# EAGLE design ADC33 (EAGLE 5.06)
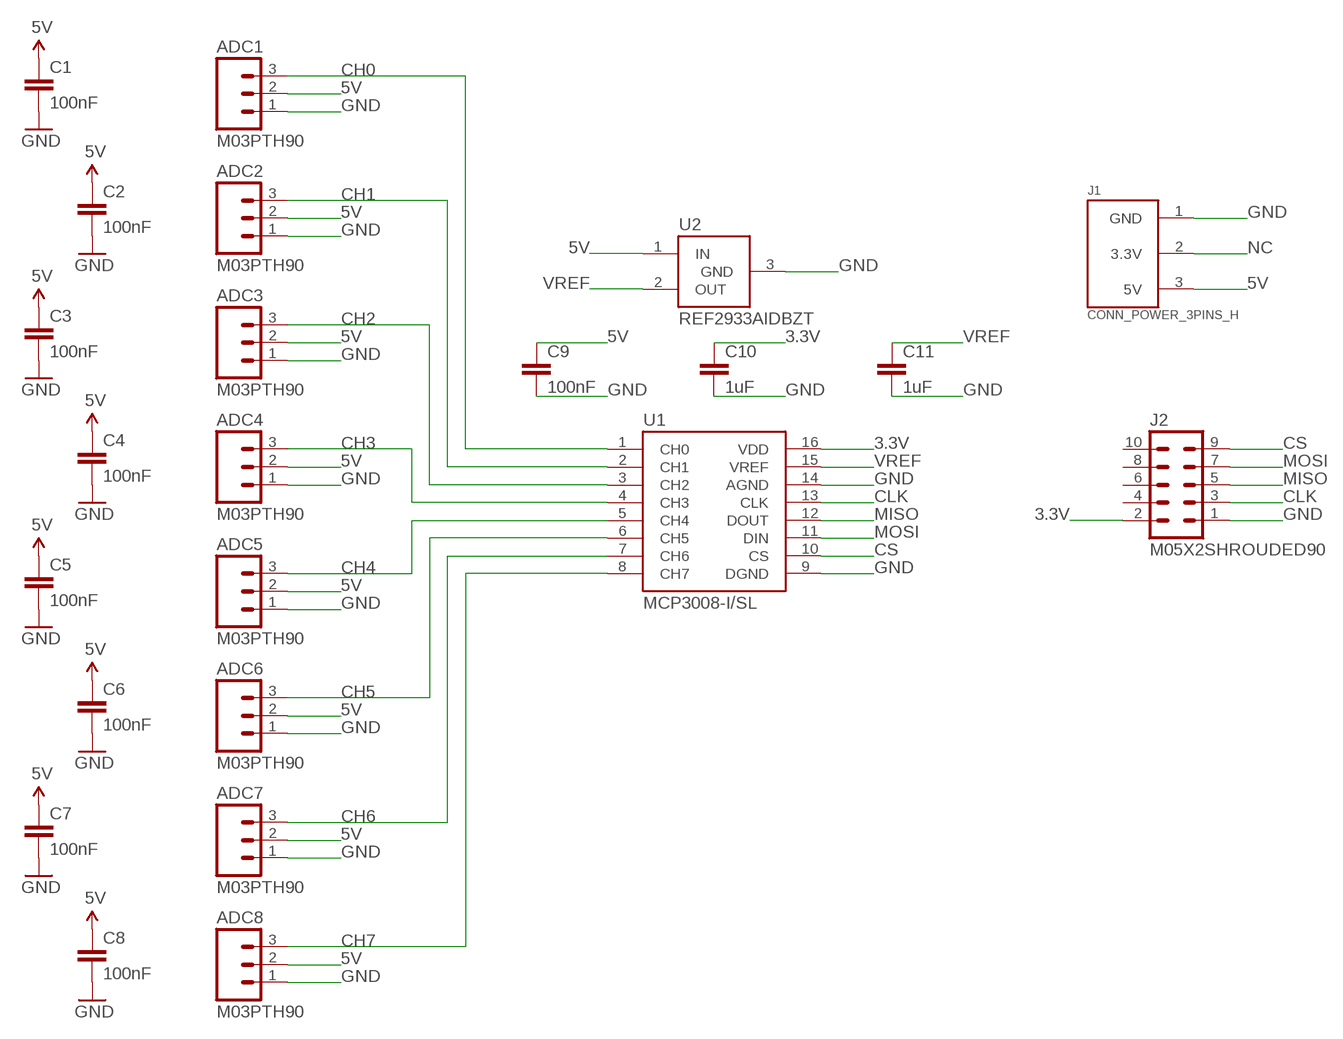
[diagram p0: schematic, sheet 1]

## Parts
ADC1  M03PTH90  [1X03/90]
ADC2  M03PTH90  [1X03/90]
ADC3  M03PTH90  [1X03/90]
ADC4  M03PTH90  [1X03/90]
ADC5  M03PTH90  [1X03/90]
ADC6  M03PTH90  [1X03/90]
ADC7  M03PTH90  [1X03/90]
ADC8  M03PTH90  [1X03/90]
C1  100nF  CAP0805  [0805]
C2  100nF  CAP0805  [0805]
C3  100nF  CAP0805  [0805]
C4  100nF  CAP0805  [0805]
C5  100nF  CAP0805  [0805]
C6  100nF  CAP0805  [0805]
C7  100nF  CAP0805  [0805]
C8  100nF  CAP0805  [0805]
C9  100nF  CAP0805  [0805]
C10  1uF  CAP0805  [0805]
C11  1uF  CAP0805  [0805]
J1  CONN_POWER_3PINS_H  [3PINS_3.81MM_90DEG]
J2  M05X2SHROUDED90  [2X05/90/SHROUDED]
U1  MCP3008-I/SL  [SOIC-16]
U2  REF2933AIDBZT  [SOT23-3]

## Nets
3.3V: C10.1 J2.2 U1.16(VDD)
5V: ADC1.2 ADC2.2 ADC3.2 ADC4.2 ADC5.2 ADC6.2 ADC7.2 ADC8.2 C1.1 C2.1 C3.1 C4.1 C5.1 C6.1 C7.1 C8.1 C9.1 J1.3(5V) U2.1(IN)
CH0: ADC1.3 U1.1(CH0)
CH1: ADC2.3 U1.2(CH1)
CH2: ADC3.3 U1.3(CH2)
CH3: ADC4.3 U1.4(CH3)
CH4: ADC5.3 U1.5(CH4)
CH5: ADC6.3 U1.6(CH5)
CH6: ADC7.3 U1.7(CH6)
CH7: ADC8.3 U1.8(CH7)
CLK: J2.3 U1.13(CLK)
CS: J2.9 U1.10(CS)
GND: ADC1.1 ADC2.1 ADC3.1 ADC4.1 ADC5.1 ADC6.1 ADC7.1 ADC8.1 C1.2 C2.2 C3.2 C4.2 C5.2 C6.2 C7.2 C8.2 C9.2 C10.2 C11.2 J1.1(GND) J2.1 U1.9(DGND) U1.14(AGND) U2.3(GND)
MISO: J2.5 U1.12(DOUT)
MOSI: J2.7 U1.11(DIN)
NC: J1.2(3.3V)
VREF: C11.1 U1.15(VREF) U2.2(OUT)
Unconnected: J2.4 J2.6 J2.8 J2.10

## Library data of the parts
ADC1-ADC8 = Robot:M03: 3-PIN HEADER Standard 3-pin 0.1" header.
C1-C11 = Robot:CAP: CAPACITOR
J1 = Robot:CONN_POWER_3PINS: POWER CONNECTOR for logic boards. Provides 3.3V and 5V.
J2 = Robot:M05X2: 10-PIN DUAL ROW HEADER Standard 10-pin dual row 0.1" header.
U1 = Robot:MCP3008: MCP3008 8-channel 10-bit A/D converter with SPI Interface
U2 = Robot:REF2933

## Board
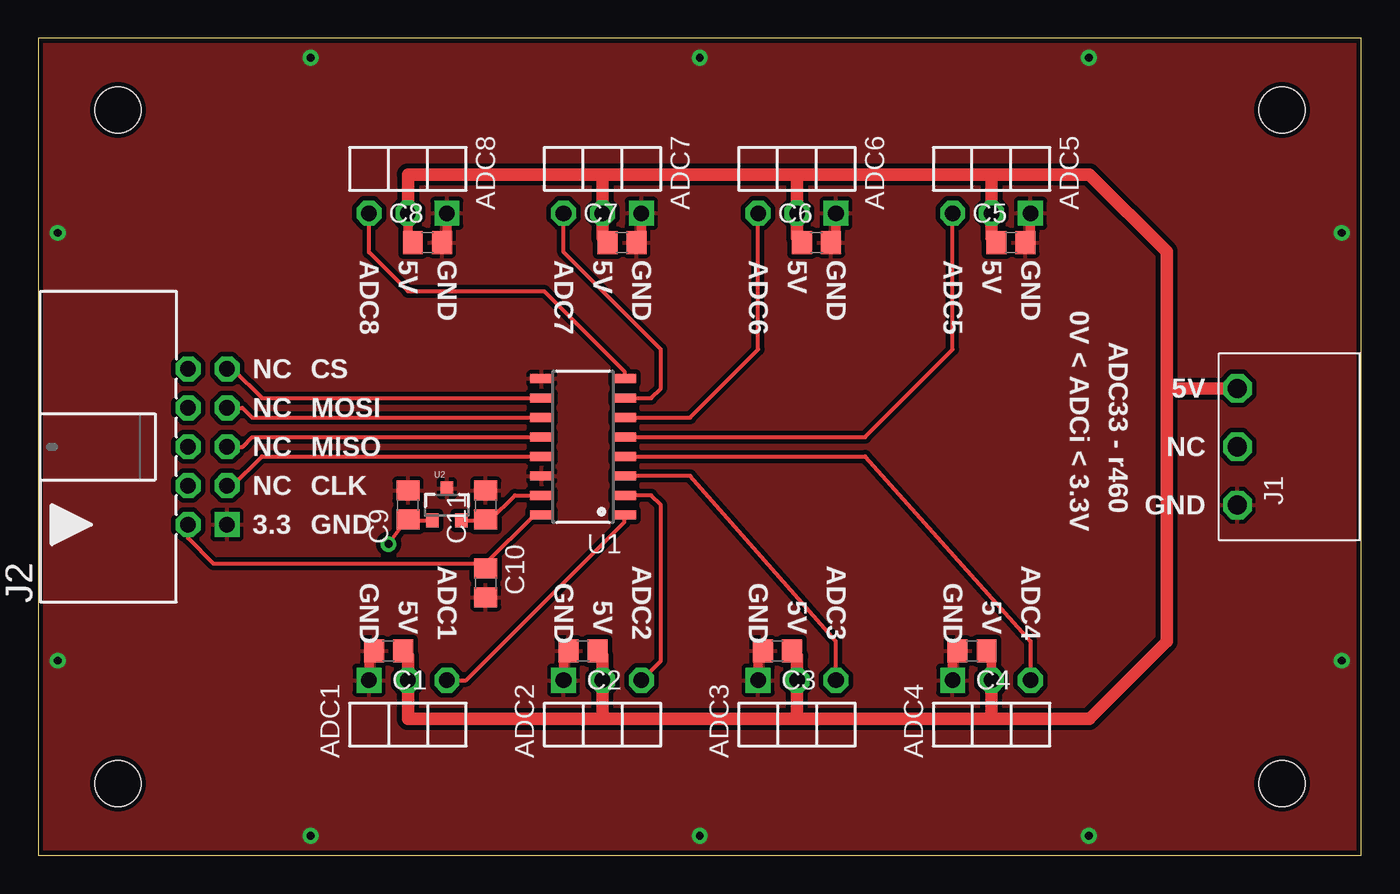
[diagram p1: board, top side]
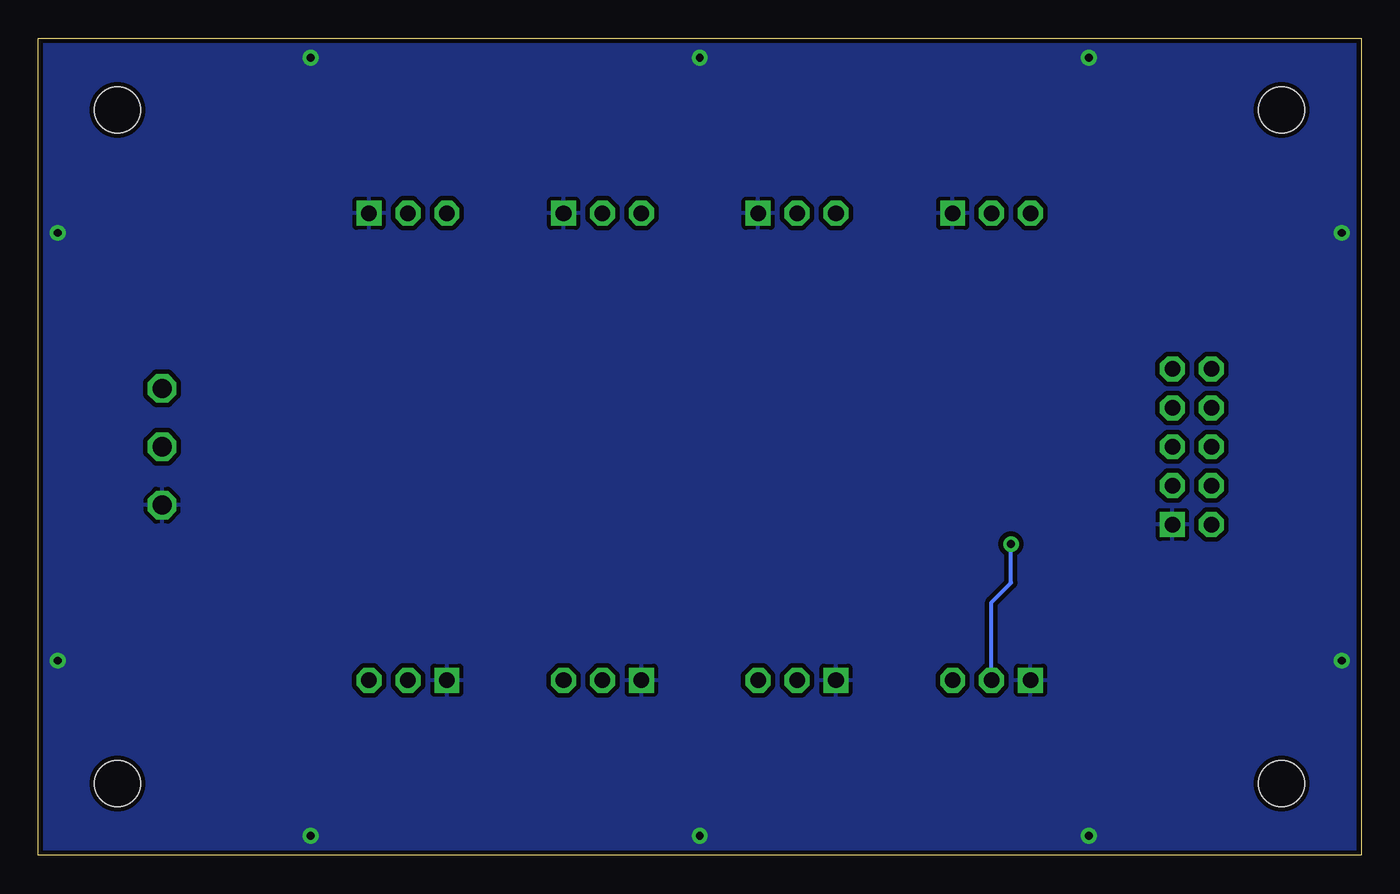
[diagram p2: board, bottom side, seen from below]

Size 86.36 x 53.34 mm. Coordinates in mm from the lower left corner, seen from the top.
Outline: 0,0 86.36,0 86.36,53.34 0,53.34 0,0
Copper layers (1*16): Top 0.035mm / dielectric 1.5mm / Bottom 0.035mm
Design rules "SparkFun": minimum track width 8mil, minimum drill 20mil, track to track 8mil, track to pad 8mil, pad to pad 8mil, via to via 8mil, smd to smd 8mil, copper to edge 10mil, drill to drill 8mil, minimum pad ring 12mil, minimum via ring 10mil, stop-mask expansion 4mil, vias tented up to drill 25mil, thermal gap 10mil
Holes 3 mm at 5.2,48.67 5.2,4.67 81.2,48.67 81.2,4.67

### Footprints (pad centres in the part's own frame; a part is rotated, then mirrored left to right if it is on the bottom)
1X03/90 = drill 1.016 square: 1 -2.54,-0.01 | drill 1.016 octagon: 2 0,-0.01; 3 2.54,-0.01
0805 = smd 1.3 x 1.5: 1 -0.95,0; 2 0.95,0
3PINS_3.81MM_90DEG = drill 1.25 octagon: 1 -3.81,3; 2 0,3; 3 3.81,3
2X05/90/SHROUDED = drill 1.016 square: 1 -5.08,-1.27 | drill 1.016 octagon: 2 -5.08,1.27; 3 -2.54,-1.27; 4 -2.54,1.27; 5 0,-1.27; 6 0,1.27; 7 2.54,-1.27; 8 2.54,1.27; 9 5.08,-1.27; 10 5.08,1.27
SOIC-16 = smd 0.6 x 1.5: 1 0,-2.7; 2 1.27,-2.7; 3 2.54,-2.7; 4 3.81,-2.7; 5 5.08,-2.7; 6 6.35,-2.7; 7 7.62,-2.7; 8 8.89,-2.7; 9 8.89,2.7; 10 7.62,2.7; 11 6.35,2.7; 12 5.08,2.7; 13 3.81,2.7; 14 2.54,2.7; 15 1.27,2.7; 16 0,2.7
SOT23-3 = smd 0.8 x 0.9: 1 -0.95,-1; 2 0.95,-1; 3 0,1.1

### Placement (x,y rotation side)
ADC1  24.13,11.43 0 top
ADC2  36.83,11.43 0 top
ADC3  49.53,11.43 0 top
ADC4  62.23,11.43 0 top
ADC5  62.23,41.91 180 top
ADC6  49.53,41.91 180 top
ADC7  36.83,41.91 180 top
ADC8  24.13,41.91 180 top
C1  22.86,13.34 180 top
C2  35.56,13.34 180 top
C3  48.26,13.34 180 top
C4  60.96,13.34 180 top
C5  63.5,40.01 0 top
C6  50.8,40.01 0 top
C7  38.1,40.01 0 top
C8  25.4,40.01 0 top
C9  24.13,22.86 90 top
C10  29.21,17.78 270 top
C11  29.21,22.86 90 top
J1  81.28,26.67 90 top
J2  11.05,26.67 90 top
U1  35.56,22.23 90 top
U2  26.67,22.86 0 top

### Tracks (layer width: path | path; a pad name or v marks a point on that pad's centre or on a via)
3.3V
  Top 0.254: J2.2 9.78,20.7 11.43,19.05 29.21,19.05 | U1.16 32.38,22.23 29.21,19.05 | 29.21,19.05 C10.1
5V  (via drill 0.51)
  Top 0.254: 62.23,13.02 C4.1 | 49.53,13.02 C3.1 | 36.83,13.02 C2.1 | 24.13,13.02 C1.1 | U2.1 24.18,21.86 C9.1 23.81,21.59 v22.86,20.32 | 24.13,40.33 C8.1 | 36.83,40.33 C7.1 | 49.53,40.33 C6.1 | 62.23,40.33 C5.1
  Top 0.61: ADC4.2 62.23,13.02 | 49.53,13.02 ADC3.2 | 36.83,13.02 ADC2.2 | 24.13,13.02 ADC1.2 | 24.13,40.33 ADC8.2 | 36.83,40.33 36.83,40.64 ADC7.2 | ADC6.2 49.53,40.33 | ADC5.2 62.23,40.33
  Top 0.813: 73.66,30.48 J1.3 | 73.66,30.48 73.66,39.42 68.63,44.45 62.23,44.45 | 62.23,44.45 ADC5.2 | 62.23,44.45 62.23,40.33 | 62.23,44.45 49.53,44.45 | 49.53,44.45 ADC6.2 | 49.53,44.45 49.53,40.33 | 49.53,44.45 36.83,44.45 | 36.83,44.45 36.83,40.64 | 36.83,44.45 36.83,40.33 | 36.83,44.45 24.13,44.45 ADC8.2 | 62.23,8.89 68.6,8.89 73.66,13.95 73.66,30.48 | 49.53,8.89 49.53,13.02 | 49.53,8.89 62.23,8.89 | 36.83,8.89 36.83,13.02 | 36.83,8.89 49.53,8.89 | 24.13,13.02 24.13,8.89 36.83,8.89 | 62.23,8.89 ADC4.2
  Bottom 0.254: ADC7.2 | v22.86,20.32 22.86,17.78 24.13,16.51 ADC1.2
CH0
  Top 0.254: ADC1.3 27.94,11.43 38.26,21.75 U1.1
CH1
  Top 0.254: U1.2 40.01,23.5 40.64,22.86 40.64,12.69 ADC2.3
CH2
  Top 0.254: U1.3 42.55,24.77 52.07,13.97 ADC3.3
CH3
  Top 0.254: ADC4.3 64.77,13.97 53.98,26.04 U1.4
CH4
  Top 0.254: ADC5.3 59.69,33.02 53.98,27.3 U1.5
CH5
  Top 0.254: U1.6 42.55,28.57 46.99,33.02 ADC6.3
CH6
  Top 0.254: U1.7 40.01,29.84 40.64,30.48 40.64,33.02 34.29,39.37 ADC7.3
CH7
  Top 0.254: ADC8.3 21.59,39.37 24.13,36.83 33.02,36.83 38.1,31.75 38.26,31.59 U1.8
CLK
  Top 0.254: U1.13 14.61,26.04 12.7,24.13 J2.3
CS
  Top 0.254: J2.9 12.7,31.75 14.61,29.84 U1.10
GND  (via drill 0.51)
  Top 0.254: 59.69,13.02 C4.2 | 46.99,13.02 C3.2 | 34.29,13.02 C2.2 | 21.59,13.02 C1.2 | C8.2 26.67,40.33 | C7.2 39.37,40.33 | C6.2 52.07,40.33 | C5.2 64.77,40.33
  Top 0.61: ADC4.1 59.69,13.02 | ADC3.1 46.99,13.02 | ADC2.1 34.29,13.02 | ADC1.1 21.59,13.02 | 26.67,40.33 ADC8.1 | 39.37,40.33 ADC7.1 | 52.07,40.33 ADC6.1 | 64.77,40.33 ADC5.1
  other vias: 17.78,52.07 43.18,52.07 68.58,52.07 85.09,40.64 85.09,12.7 68.58,1.27 43.18,1.27 17.78,1.27 1.27,12.7 1.27,40.64
  pour Bottom (isolate 0.305): 0,0 0,53.34 86.36,53.34 86.36,0
  pour Top (isolate 0.305): 0,0 0,53.34 86.36,53.34 86.36,0
MISO
  Top 0.254: J2.5 13.34,26.67 13.97,27.3 U1.12
MOSI
  Top 0.254: J2.7 13.34,29.21 13.97,28.57 U1.11
VREF
  Top 0.254: U2.2 29.16,21.86 C11.1 29.53,21.91 31.11,23.5 U1.15

### Text on the board
tPlace: ADC8 | 5V | GND | ADC7 | 5V | GND | ADC6 | 5V | GND | ADC5 | 5V | GND | 0V < ADCi < 3.3V | ADC33 - r460 | NC | CS | 5V | NC | MOSI | NC | NC | MISO | NC | CLK | GND | 3.3 | GND | ADC1 | ADC2 | ADC3 | ADC4 | GND | GND | GND | GND | 5V | 5V | 5V | 5V